# EAGLE design sy88932l_breakout (EAGLE 9.2.2)
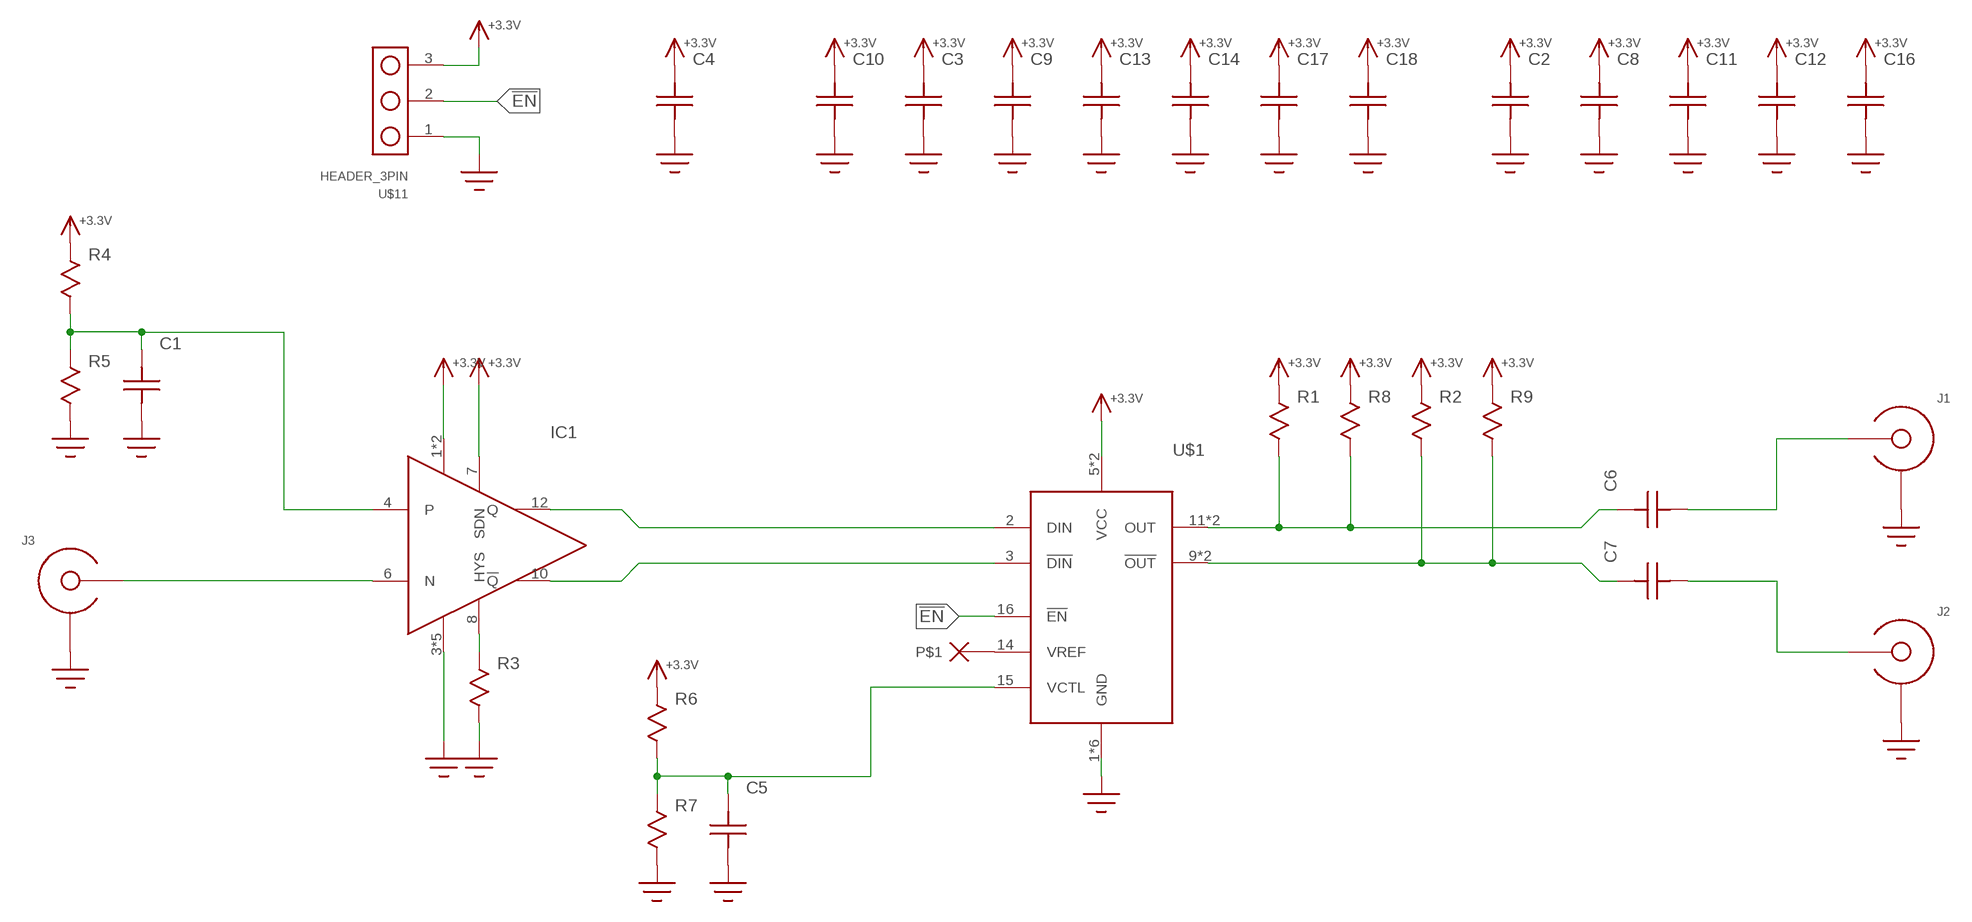
[diagram p0: schematic, sheet 1]

## Parts
C1  C0603  [C0603]
C2  C  [C0402]
C3  C0603  [C0603]
C4  C1206  [1206]
C5  C0603  [C0603]
C6  C  [C0402]
C7  C  [C0402]
C8  C  [C0402]
C9  C0603  [C0603]
C10  C0603  [C0603]
C11  C  [C0402]
C12  C  [C0402]
C13  C0603  [C0603]
C14  C0603  [C0603]
C16  C  [C0402]
C17  C0603  [C0603]
C18  C0603  [C0603]
IC1  ADCMP607  [QFN12-3X3]
J1  SMA_END_LAUNCH4L  [SMA_EDGE_LAUNCH]
J2  SMA_END_LAUNCH4L  [SMA_EDGE_LAUNCH]
J3  SMA_END_LAUNCH4L  [SMA_EDGE_LAUNCH]
R1  R0402  [0402]
R2  R0402  [0402]
R3  R0603  [R0603]
R4  R0603  [R0603]
R5  R0603  [R0603]
R6  R0603  [R0603]
R7  R0603  [R0603]
R8  R0402  [0402]
R9  R0402  [0402]
U$1  SY88932L  [TQFN16]
U$11  HEADER_3PIN  [HEADER_3PIN]
U$20  NO_CONNECT  (no package)

## Nets
!EN!: U$1.16(!EN!) U$11.2
+3.3V: C2.2 C3.P$2 C4.P$2 C8.2 C9.P$2 C10.P$2 C11.2 C12.2 C13.P$2 C14.P$2 C16.2 C17.P$2 C18.P$2 IC1.1(VCC) IC1.2(VCC) IC1.7(SDN) R1.1 R2.1 R4.P$1 R6.P$1 R8.1 R9.1 U$1.5(VCC) U$1.6(VCC) U$11.3
D_N: IC1.10(!Q!) U$1.3(!DIN!)
D_P: IC1.12(Q) U$1.2(DIN)
GND: C1.P$1 C2.1 C3.P$1 C4.P$1 C5.P$1 C8.1 C9.P$1 C10.P$1 C11.1 C12.1 C13.P$1 C14.P$1 C16.1 C17.P$1 C18.P$1 IC1.3(VEE) IC1.5(VEE) IC1.9(VEE) IC1.11(VEE) IC1.EP(VEE) J1.BOTTOM_PAD(SHIELD) J1.GND@1(SHIELD) J1.GND@2(SHIELD) J1.GND@3(SHIELD) J1.GND@4(SHIELD) J1.GND@5(SHIELD) J1.GND@6(SHIELD) J1.GND@7(SHIELD) J1.GND@8(SHIELD) J1.GND@14(SHIELD) J1.GND@15(SHIELD) J1.GND@16(SHIELD) J1.GND@17(SHIELD) J1.GND_PAD1(SHIELD) J1.GND_PAD2(SHIELD) J2.BOTTOM_PAD(SHIELD) J2.GND@1(SHIELD) J2.GND@2(SHIELD) J2.GND@3(SHIELD) J2.GND@4(SHIELD) J2.GND@5(SHIELD) J2.GND@6(SHIELD) J2.GND@7(SHIELD) J2.GND@8(SHIELD) J2.GND@14(SHIELD) J2.GND@15(SHIELD) J2.GND@16(SHIELD) J2.GND@17(SHIELD) J2.GND_PAD1(SHIELD) J2.GND_PAD2(SHIELD) J3.BOTTOM_PAD(SHIELD) J3.GND@1(SHIELD) J3.GND@2(SHIELD) J3.GND@3(SHIELD) J3.GND@4(SHIELD) J3.GND@5(SHIELD) J3.GND@6(SHIELD) J3.GND@7(SHIELD) J3.GND@8(SHIELD) J3.GND@14(SHIELD) J3.GND@15(SHIELD) J3.GND@16(SHIELD) J3.GND@17(SHIELD) J3.GND_PAD1(SHIELD) J3.GND_PAD2(SHIELD) R3.P$2 R5.P$2 R7.P$2 U$1.1(GND) U$1.4(GND) U$1.7(GND) U$1.8(GND) U$1.13(GND) U$1.EP(GND) U$11.1
N$1: IC1.8(HYS) R3.P$1
N$4: C1.P$2 IC1.4(P) R4.P$2 R5.P$1
N$5: U$1.14(VREF) U$20.P$1
N$6: IC1.6(N) J3.CENTER@1(CENTER) J3.CENTER@2(CENTER)
N$7: C5.P$2 R6.P$2 R7.P$1 U$1.15(VCTL)
N$8: C6.2 R1.2 R8.2 U$1.11(OUT) U$1.12(OUT)
N$9: C7.2 R2.2 R9.2 U$1.9(!OUT!) U$1.10(!OUT!)
N$10: C6.1 J1.CENTER@1(CENTER) J1.CENTER@2(CENTER)
N$11: C7.1 J2.CENTER@1(CENTER) J2.CENTER@2(CENTER)

## Library data of the parts
C1-C14 C16-C18 = yapo:C
IC1 = yapo:ADCMP607
J1-J3 = yapo:SMA_END_LAUNCH
R1-R9 = yapo:R
U$1 = yapo:SY88932L
U$11 = yapo:HEADER_3PIN
U$20 = yapo:NO_CONNECT

## Net classes
0 default: clearance 0.178 mm
1 diff-pair: width 0.305 mm, clearance 0.508 mm
2 diff-pair-10: width 0.254 mm, clearance 0.508 mm

## Board
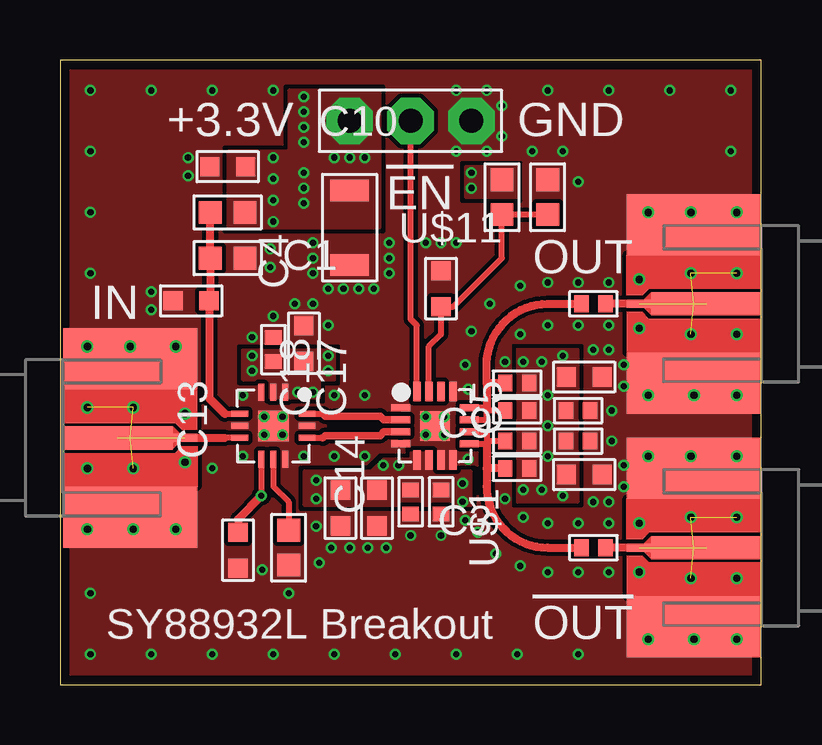
[diagram p1: board, top side]
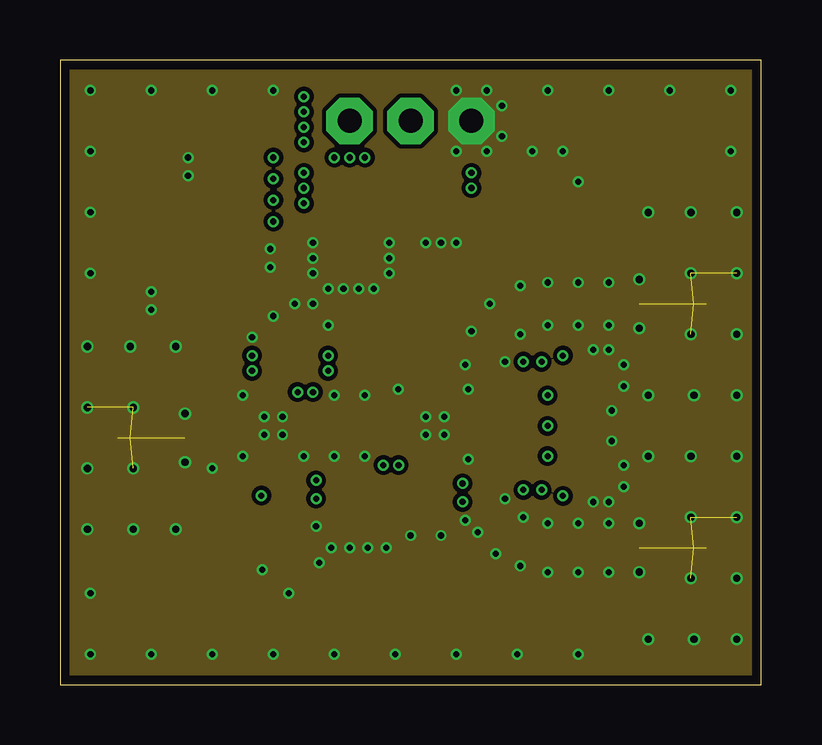
[diagram p2: board, inner layer Route2]
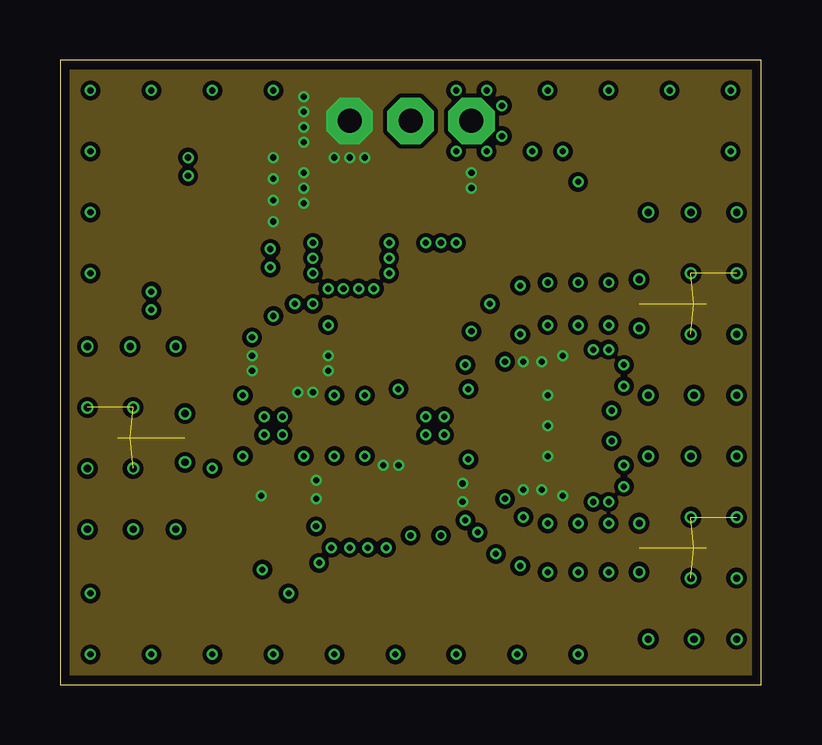
[diagram p3: board, inner layer Route15]
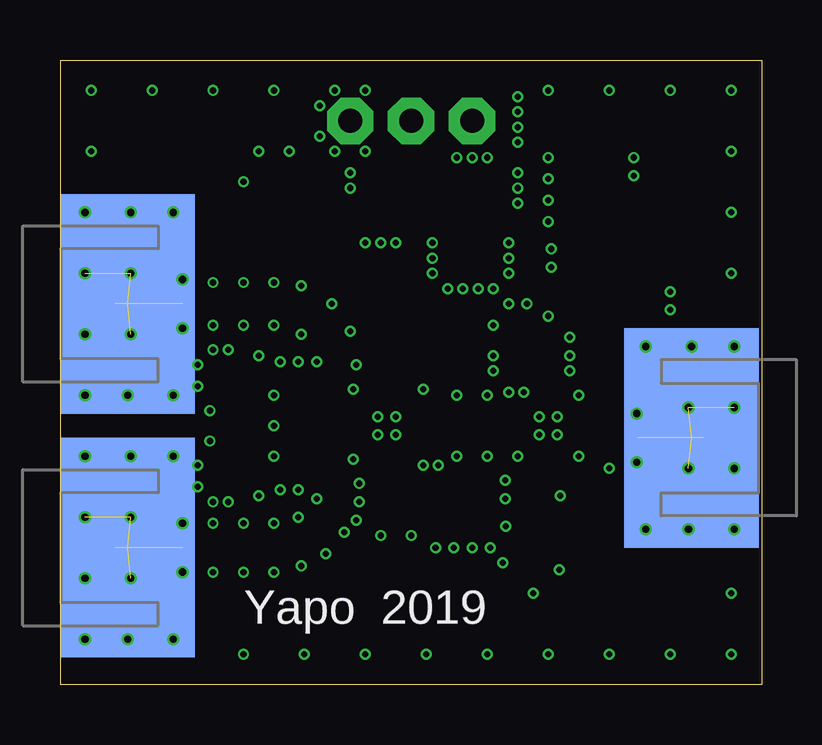
[diagram p4: board, bottom side, seen from below]

Size 29.21 x 26.04 mm. Coordinates in mm from the lower left corner, seen from the top.
Outline: 0,0 29.21,0 29.21,26.04 0,26.04 0,0
Copper layers (1*2*15*16): Top 0.035559375mm / dielectric 0.17018125mm / Route2 0.01778125mm / dielectric 47mil / Route15 0.01778125mm / dielectric 0.17018125mm / Bottom 0.035559375mm
Design rules "oshpark-4layer *": minimum track width 5mil, minimum drill 10mil, track to track 5mil, track to pad 5mil, pad to pad 5mil, via to via 5mil, smd to smd 5mil, copper to edge 15mil, drill to drill 6mil, minimum pad ring 4mil, minimum via ring 4mil, stop-mask expansion 2.5mil, vias tented up to drill 20mil, thermal gap 10mil
tRestrict: area 11.2,10.2 to 13.3,11.4

### Footprints (pad centres in the part's own frame; a part is rotated, then mirrored left to right if it is on the bottom)
C0603 = smd 0.8 x 0.8: P$1 -0.75,0; P$2 0.75,0
C0402 = smd 0.6 x 0.7: 1 -0.5,0; 2 0.5,0
1206 = smd 0.9 x 1.6: P$1 -1.55,0; P$2 1.55,0
QFN12-3X3 = smd 0.7 x 0.25: 1 -1.4,0.5; 2 -1.4,0; 3 -1.4,-0.5; 7 1.4,-0.5; 8 1.4,0; 9 1.4,0.5 | smd 0.25 x 0.7: 4 -0.5,-1.4; 5 0,-1.4; 6 0.5,-1.4; 10 0.5,1.4; 11 0,1.4; 12 -0.5,1.4 | smd 1.27 x 1.27: EP 0,0
SMA_EDGE_LAUNCH = smd 5.588 x 9.144 bottom: BOTTOM_PAD 2.794,0 | smd 4.572 x 0.965: CENTER@1 2.286,0 | smd 1.016 x 0.33: CENTER@2 5.08,0 | drill 0.3: GND@1 1.016,3.81; GND@2 4.699,3.81; GND@3 1.016,1.27; GND@4 5.08,1.016; GND@5 1.016,-1.27; GND@6 5.08,-1.016; GND@7 1.016,-3.81; GND@8 4.699,-3.81; GND@14 2.794,3.81; GND@15 2.921,-3.81; GND@16 2.921,-1.27; GND@17 2.921,1.27 | smd 5.588 x 2.54: GND_PAD1 2.794,3.302; GND_PAD2 2.794,-3.302
0402 = smd 0.6 x 0.7: 1 -0.5,0; 2 0.5,0
R0603 = smd 0.95 x 0.95: P$1 -0.725,0; P$2 0.725,0
TQFN16 = smd 0.3 x 0.8: 1 -0.75,-1.425; 2 -0.25,-1.425; 3 0.25,-1.425; 4 0.75,-1.425; 9 0.75,1.425; 10 0.25,1.425; 11 -0.25,1.425; 12 -0.75,1.425 | smd 0.8 x 0.3: 5 1.425,-0.75; 6 1.425,-0.25; 7 1.425,0.25; 8 1.425,0.75; 13 -1.425,0.75; 14 -1.425,0.25; 15 -1.425,-0.25; 16 -1.425,-0.75 | smd 1.23 x 1.23: EP 0,0
HEADER_3PIN = drill 1 pad 1.93 octagon: 1 -2.54,0; 2 0,0; 3 2.54,0

### Placement (x,y rotation side)
C1  5.46,16 0 top
C2  21.59,10.16 180 top
C3  21.84,8.76 180 top
C4  12.06,19.05 90 top
C5  15.88,16.51 270 top
C6  22.23,15.88 180 top
C7  22.23,5.71 180 top
C8  21.59,11.43 180 top
C9  21.84,12.83 180 top
C10  6.99,21.59 0 top
C11  15.88,7.62 90 top
C12  8.89,13.97 270 top
C13  7.42,5.61 90 top
C14  10.16,14.22 270 top
C16  14.61,7.62 90 top
C17  13.21,7.37 90 top
C18  11.68,7.37 90 top
IC1  8.89,10.79 270 top
J1  29.21,15.88 180 top
J2  29.21,5.71 180 top
J3  0.13,10.29 0 top
R1  19.05,12.57 180 top
R2  19.05,10.16 180 top
R3  9.53,5.71 270 top
R4  6.99,19.68 180 top
R5  6.99,17.78 0 top
R6  18.41,20.32 270 top
R7  20.32,20.32 90 top
R8  19.05,11.43 180 top
R9  19.05,9.02 180 top
U$1  15.62,10.79 270 top
U$11  14.61,23.5 180 top

### Tracks (layer width: path | path; a pad name or v marks a point on that pad's centre or on a via)
!EN!
  Top 0.254: U$1.16 14.87,14.97 14.61,15.24 U$11.2
+3.3V  (via drill 0.25)
  Top 0.254: IC1.7 v8.39,7.88
  Top 0.33: v8.39,7.88 7.42,6.91 C13.P$2
  other vias: 19.3,13.46 19.3,8.13 20.07,13.46 20.07,8.13 20.32,12.06 20.32,10.79 20.32,9.53 20.95,13.72 20.95,7.87 8.89,21.97 8.89,19.3 8.89,21.08 8.89,20.19 9.91,12.19 10.54,12.19 8,13.72 8,13.08 11.18,13.72 11.18,13.08 14.11,9.15 10.68,8.52 10.68,7.75 16.77,8.39 16.77,7.63 13.47,9.15 11.43,21.97 12.06,21.97 12.7,21.97 10.16,24.51 10.16,23.88 10.16,23.24 10.16,22.61 10.16,21.34 10.16,20.7 10.16,20.07 17.14,21.34 17.14,20.7
  pour Top (no thermals): 19.05,13.97 19.05,7.62 21.59,7.62 21.59,13.97
  pour Route15 (no thermals): 0,0 29.21,0 29.21,26.04 0,26.04
  pour Top (no thermals): 8.76,11.94 8.76,12.7 7.62,12.7 7.62,13.97 11.43,13.97 11.43,12.7 10.79,12.7 10.79,11.94
  pour Top (no thermals): 6.99,22.23 6.99,19.05 9.53,19.05 9.53,22.23
  pour Top (no thermals): 10.16,7.49 17.14,7.49 17.14,8.89 15.49,8.89 15.49,9.65 14.61,9.65 14.61,9.4 13.46,9.4 12.95,8.89 10.16,8.89
  pour Top (no thermals): 9.53,19.05 13.34,19.05 13.34,24.77 9.53,24.77
  pour Top (no thermals): 19.05,21.59 16.89,21.59 16.89,20.32 19.05,20.32
D_N
  Top 0.254: IC1.10 10.96,10.29
  Top 0.305: 10.96,10.29 11.05,10.39 13.34,10.39 13.49,10.54 U$1.3
D_P
  Top 0.254: IC1.12 10.96,11.29
  Top 0.305: 10.96,11.29 11.05,11.2 13.34,11.2 13.49,11.04 U$1.2
GND  (via drill 0.25)  (9 unrouted)
  other vias: 12.7,12.06 11.43,12.06 11.43,9.53 12.7,9.53 22.86,13.97 22.86,7.62 22.23,7.62 22.23,13.97 23.5,12.45 22.99,11.43 22.99,10.16 23.5,9.14 23.5,13.34 23.5,8.26 5.33,21.97 5.33,21.21 8.76,18.16 8.76,17.4 3.81,15.62 3.81,16.38 9.78,15.88 10.54,15.88 8.89,15.37 11.18,14.99 8,14.48 7.62,12.06 7.62,9.53 10.16,9.53 8.43,4.8 9.53,3.81 10.79,5.08 22.86,16.76 21.59,16.76 20.32,16.76 22.86,14.99 21.59,14.99 20.32,14.99 19.18,14.61 18.54,13.46 17.02,12.32 14.1,12.32 17.02,9.4 8.51,11.18 9.27,11.18 9.27,10.41 8.51,10.41 15.24,11.18 16,11.18 15.24,10.41 16,10.41 10.67,6.6 11.3,5.71 12.06,5.71 12.83,5.71 13.59,5.71 14.61,6.22 15.88,6.22 16.89,6.86 6.35,9.02 10.54,18.41 10.54,17.78 10.54,17.14 11.18,16.51 11.81,16.51 12.45,16.51 13.08,16.51 13.72,17.14 13.72,17.78 13.72,18.41 19.18,16.64 17.91,15.88 17.14,14.73 16.89,13.34 22.86,6.73 21.59,6.73 20.32,6.73 19.3,6.99 18.54,7.75 17.4,6.35 22.86,4.7 21.59,4.7 20.32,4.7 19.18,4.95 18.16,5.46 1.27,1.27 1.27,3.81 3.81,1.27 6.35,1.27 8.89,1.27 11.43,1.27 13.97,1.27 16.51,1.27 19.05,1.27 21.59,1.27 1.27,24.77 1.27,22.23 1.27,19.68 1.27,17.14 3.81,24.77 6.35,24.77 8.89,24.77 27.94,24.77 27.94,22.23 25.4,24.77 22.86,24.77 20.32,24.77 17.78,24.77 16.51,24.77 16.51,22.23 17.78,22.23 18.41,24.13 18.41,22.86 19.68,22.23 20.95,22.23 21.59,20.95 15.88,18.41 16.51,18.41 15.24,18.41
  pour Top (rank 2, no thermals): 0,0 29.21,0 29.21,26.04 0,26.04
  pour Route2 (no thermals): 0,0 29.21,0 29.21,26.04 0,26.04
N$1
  Top 0.254: IC1.8 8.89,8.26 9.53,7.62 R3.P$1
N$4
  Top 0.254: 6.87,11.29 IC1.4
  Top 0.33: R4.P$2 R5.P$1 6.26,16.05 C1.P$2 6.21,11.95 6.87,11.29
N$6  (1 unrouted)
  Top 0.254: IC1.6 6.35,10.29
  Top 0.33: J3.CENTER@2 6.35,10.29 6.86,10.29
N$7
  Top 0.254: U$1.15 15.37,14.1 15.88,14.61 C5.P$2 16.39,15.76 18.41,17.78 R6.P$2 R7.P$1
N$8
  Top 0.254: U$1.12 17.78,11.54 17.78,11.43 | U$1.11 17.78,11.04 17.78,11.43 | R8.2 17.78,11.43
  Top 0.33: 17.78,12.57 17.78,13.34 arc-90 20.32,15.88 C6.2 | R1.2 17.78,12.57 | 17.78,12.57 17.78,11.54
N$9
  Top 0.254: U$1.10 17.78,10.54 17.78,10.04 | U$1.9 17.78,10.04 | R2.2 17.89,10.16 arc90 17.78,10.04
  Top 0.33: 17.78,10.04 17.78,9.02 | 17.78,9.02 17.78,8.26 arc90 20.32,5.71 C7.2 | R9.2 17.78,9.02
N$10  (1 unrouted)
  Top 0.33: J1.CENTER@2 C6.1
N$11  (1 unrouted)
  Top 0.33: J2.CENTER@2 C7.1

### Text on the board
tPlace: +3.3V | GND | !EN! | OUT | IN | SY88932L Breakout | !OUT!
bPlace: 2019 | Yapo